# Altium project QMK_CTRL_V2.PrjPcb
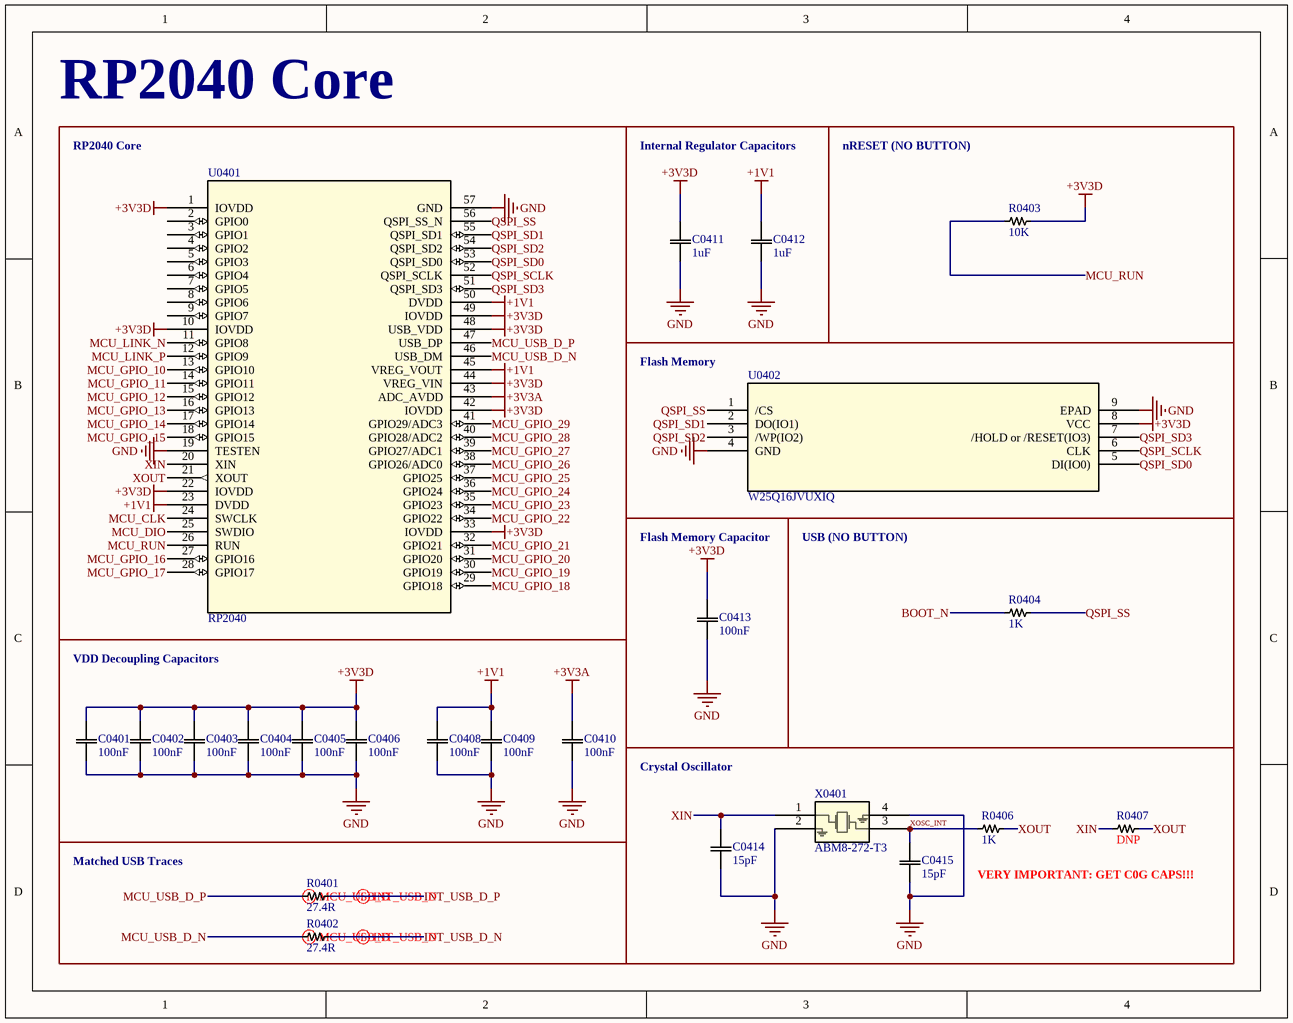
[diagram p0: rp2040_core.SchDoc]
3 sheets, 51 parts. Net scope: global (net labels, ports and power ports of the same name join across sheets).
Board file: main.PcbDoc
Sheets:
  rp2040_core.SchDoc
  peripherals.SchDoc
  sensor_array_interface.SchDoc

## Sheet rp2040_core.SchDoc
size A; SheetNumber: 1; SheetTotal: 3

### Parts
C0401  100nF  [CAPC10555_55N_KEM]
C0402  100nF  [CAPC10555_55N_KEM]
C0403  100nF  [CAPC10555_55N_KEM]
C0404  100nF  [CAPC10555_55N_KEM]
C0405  100nF  [CAPC10555_55N_KEM]
C0406  100nF  [CAPC10555_55N_KEM]
C0408  100nF  [CAPC10555_55N_KEM]
C0409  100nF  [CAPC10555_55N_KEM]
C0410  100nF  [CAPC10555_55N_KEM]
C0411  1uF  [CAPC10555_55N_KEM]
C0412  1uF  [CAPC10555_55N_KEM]
C0413  100nF  [CAPC10555_55N_KEM]
C0414  15pF  [CAPC10555_55N_KEM]
C0415  15pF  [CAPC10555_55N_KEM]
R0401  27.4R  [RES0402_CPF_TYCO_TYC]
R0402  27.4R  [RES0402_CPF_TYCO_TYC]
R0403  10K  [RES0402_CPF_TYCO_TYC]
R0404  1K  [RES0402_CPF_TYCO_TYC]
R0406  1K  [RES0402_CPF_TYCO_TYC]
R0407  DNP  [RES0402_CPF_TYCO_TYC]
U0401  RP2040  [IC57_RP2040]
U0402  W25Q16JVUXIQ  [W25Q16JVUXIQ_WIN]
X0401  ABM8-272-T3  [ABM8-272-T3_ABR]

### Blocks framed on the sheet
RP2040 Core: U0401
Internal Regulator Capacitors: C0411 C0412
nRESET (NO BUTTON): R0403
Flash Memory: U0402
Flash Memory Capacitor: C0413
USB (NO BUTTON): R0404
VDD Decoupling Capacitors: C0401 C0402 C0403 C0404 C0405 C0406 C0408 C0409 C0410
Matched USB Traces: R0401 R0402

### Nets
+1V1: C0408.2 C0409.2 C0412.2 U0401.23(DVDD) U0401.45(VREG_VOUT) U0401.50(DVDD)
+3V3A: C0410.2 U0401.43(ADC_AVDD)
+3V3D: C0401.2 C0402.2 C0403.2 C0404.2 C0405.2 C0406.2 C0411.2 C0413.2 R0403.1 U0401.1(IOVDD) U0401.10(IOVDD) U0401.22(IOVDD) U0401.33(IOVDD) U0401.42(IOVDD) U0401.44(VREG_VIN) U0401.48(USB_VDD) U0401.49(IOVDD) U0402.8(VCC)
GND: C0401.1 C0402.1 C0403.1 C0404.1 C0405.1 C0406.1 C0408.1 C0409.1 C0410.1 C0411.1 C0412.1 C0413.1 C0414.2 C0415.1 U0401.19(TESTEN) U0401.57(GND) U0402.4(GND) U0402.9(EPAD) X0401.2 X0401.4
BOOT_N: R0404.2
INT_USB_D_N: R0402.1
INT_USB_D_P: R0401.1
MCU_CLK: U0401.24(SWCLK)
MCU_DIO: U0401.25(SWDIO)
MCU_GPIO_10: U0401.13(GPIO10)
MCU_GPIO_11: U0401.14(GPIO11)
MCU_GPIO_12: U0401.15(GPIO12)  [project net FPC_GPIO_12]
MCU_GPIO_13: U0401.16(GPIO13)
MCU_GPIO_14: U0401.17(GPIO14)  [project net FPC_GPIO_14]
MCU_GPIO_15: U0401.18(GPIO15)  [project net FPC_GPIO_15]
MCU_GPIO_16: U0401.27(GPIO16)  [project net FPC_GPIO_16]
MCU_GPIO_17: U0401.28(GPIO17)
MCU_GPIO_18: U0401.29(GPIO18)
MCU_GPIO_19: U0401.30(GPIO19)
MCU_GPIO_20: U0401.31(GPIO20)  [project net FPC_GPIO_20]
MCU_GPIO_21: U0401.32(GPIO21)  [project net FPC_GPIO_21]
MCU_GPIO_22: U0401.34(GPIO22)  [project net FPC_GPIO_22]
MCU_GPIO_23: U0401.35(GPIO23)  [project net FPC_GPIO_23]
MCU_GPIO_24: U0401.36(GPIO24)  [project net FPC_GPIO_24]
MCU_GPIO_25: U0401.37(GPIO25)  [project net FPC_GPIO_25]
MCU_GPIO_26: U0401.38(GPIO26/ADC0)  [project net FPC_GPIO_26]
MCU_GPIO_27: U0401.39(GPIO27/ADC1)  [project net FPC_GPIO_27]
MCU_GPIO_28: U0401.40(GPIO28/ADC2)  [project net FPC_GPIO_28]
MCU_GPIO_29: U0401.41(GPIO29/ADC3)  [project net FPC_GPIO_29]
MCU_LINK_N: U0401.11(GPIO8)
MCU_LINK_P: U0401.12(GPIO9)
MCU_RUN: R0403.2 U0401.26(RUN)
MCU_USB_D_N: R0402.2 U0401.46(USB_DM)
MCU_USB_D_P: R0401.2 U0401.47(USB_DP)
QSPI_SCLK: U0401.52(QSPI_SCLK) U0402.6(CLK)
QSPI_SD0: U0401.53(QSPI_SD0) U0402.5(DI(IO0))
QSPI_SD1: U0401.55(QSPI_SD1) U0402.2(DO(IO1))
QSPI_SD2: U0401.54(QSPI_SD2) U0402.3(/WP(IO2))
QSPI_SD3: U0401.51(QSPI_SD3) U0402.7(/HOLD_or_/RESET(IO3))
QSPI_SS: R0404.1 U0401.56(QSPI_SS_N) U0402.1(/CS)
XIN: C0414.1 R0407.1 U0401.20(XIN) X0401.1
XOSC_INT: C0415.2 R0406.1 X0401.3
XOUT: R0406.2 R0407.2 U0401.21(XOUT)

Not connected (* = marked no-connect by the designer): U0401 2(GPIO0) 3(GPIO1) 4(GPIO2) 5(GPIO3) 6(GPIO4) 7(GPIO5) 8(GPIO6) 9(GPIO7)

### Layout directives
differential pair: INT_USB_D_N, INT_USB_D_P, MCU_USB_D_N, MCU_USB_D_P

### Notes on the sheet
- RP2040 Core
- Crystal Oscillator
- VERY IMPORTANT: GET C0G CAPS!!!

### Library data of the parts
C0401 C0402 C0403 C0404 C0405 C0406 C0408 C0409 C0410 C0411 C0412 C0413 C0414 C0415 = C0402: SMD Comm X7R, Ceramic, SMD, MLCC, Temperature Stable, 0402; Manufacturer_Name: Kemet; Manufacturer_Part_Number: C0402C104K4RACTU; Copyright: Copyright (C) 2025 Ultra Librarian. All rights reserved.; Datasheet: https://content.kemet.com/datasheets/KEM_C1002_X7R_SMD.pdf
R0401 R0402 R0403 R0404 R0406 R0407 = R0402: CPF 0402 RL; Manufacturer_Name: TE Connectivity; Manufacturer_Part_Number: CPF0402B33RE1; Copyright: Copyright (C) 2025 Ultra Librarian. All rights reserved.; Datasheet: https://www.te.com/commerce/DocumentDelivery/DDEController?Action=srchrtrv&DocNm=1773200&DocType=Data+Sheet&DocLang=English&PartCntxt=1-1879208-3&DocFormat=pdf
U0401 = RP2040: No Description Available; Manufacturer_Name: Raspberry Pi; Copyright: Copyright (C) 2025 Ultra Librarian. All rights reserved.; Manufacturer_Part_Number: RP2040; RefDes: RefDes; Type: Type
U0402 = W25Q16JVUXIQ: No Description Available; Manufacturer_Name: Winbond; Copyright: Copyright (C) 2025 Ultra Librarian. All rights reserved.; Manufacturer_Part_Number: W25Q16JVUXIQ; RefDes: RefDes; Type: Type
X0401 = ABM8-272-T3: No Description Available; Manufacturer_Name: Abracon; Type: Crystals; Copyright: Copyright (C) 2025 Ultra Librarian. All rights reserved.; Manufacturer_Part_Number: ABM8-272-T3; RefDes: RefDes

## Sheet peripherals.SchDoc
size A portrait; SheetNumber: 2; SheetTotal: 3
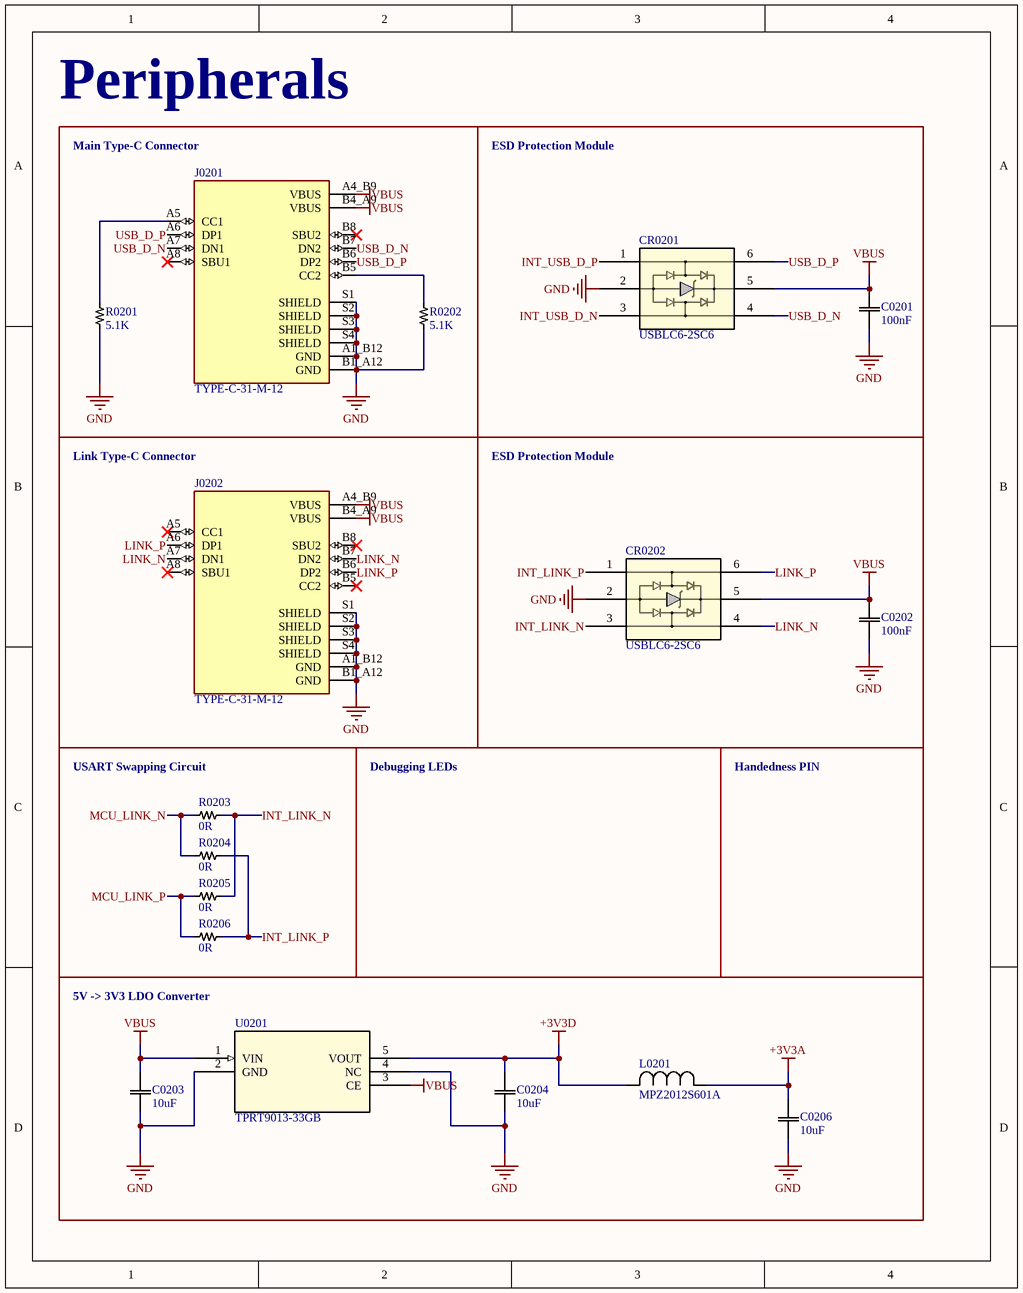
[diagram p1: peripherals.SchDoc]

### Parts
C0201  100nF  [CAPC10555_55N_KEM]
C0202  100nF  [CAPC10555_55N_KEM]
C0203  10uF  [CAPC10555_55N_KEM]
C0204  10uF  [CAPC10555_55N_KEM]
C0206  10uF  [CAPC10555_55N_KEM]
CR0201  USBLC6-2SC6  [SOT23-6L_STM]
CR0202  USBLC6-2SC6  [SOT23-6L_STM]
J0201  TYPE-C-31-M-12  [HRO_TYPE-C-31-M-12]
J0202  TYPE-C-31-M-12  [HRO_TYPE-C-31-M-12]
L0201  MPZ2012S601A  [IND_MPZ2012_TDK]
R0201  5.1K  [RES0402_CPF_TYCO_TYC]
R0202  5.1K  [RES0402_CPF_TYCO_TYC]
R0203  0R  [RES0402_CPF_TYCO_TYC]
R0204  0R  [RES0402_CPF_TYCO_TYC]
R0205  0R  [RES0402_CPF_TYCO_TYC]
R0206  0R  [RES0402_CPF_TYCO_TYC]
U0201  TPRT9013-33GB  [SOT23-5_TCP]

### Blocks framed on the sheet
Peripherals: J0201 R0201 R0202
ESD Protection Module: C0201 CR0201
Link Type-C Connector: J0202
ESD Protection Module: C0202 CR0202
5V -> 3V3 LDO Converter: C0203 C0204 C0206 L0201 U0201

### Nets
+3V3A: C0206.2 L0201.1
+3V3D: C0204.2 L0201.2 U0201.5(VOUT)
GND: C0201.1 C0202.1 C0203.1 C0204.1 C0206.1 CR0201.2 CR0202.2 J0201.A1_B12(GND) J0201.B1_A12(GND) J0201.S1(SHIELD) J0201.S2(SHIELD) J0201.S3(SHIELD) J0201.S4(SHIELD) J0202.A1_B12(GND) J0202.B1_A12(GND) J0202.S1(SHIELD) J0202.S2(SHIELD) J0202.S3(SHIELD) J0202.S4(SHIELD) R0201.1 R0202.1 U0201.2(GND) U0201.4(NC)
VBUS: C0201.2 C0202.2 C0203.2 CR0201.5 CR0202.5 J0201.A4_B9(VBUS) J0201.B4_A9(VBUS) J0202.A4_B9(VBUS) J0202.B4_A9(VBUS) U0201.1(VIN) U0201.3(CE)
INT_LINK_N: CR0202.3 R0203.1 R0205.1
INT_LINK_P: CR0202.1 R0204.1 R0206.1
INT_USB_D_N: CR0201.3
INT_USB_D_P: CR0201.1
LINK_N: CR0202.4 J0202.A7(DN1) J0202.B7(DN2)
LINK_P: CR0202.6 J0202.A6(DP1) J0202.B6(DP2)
MCU_LINK_N: R0203.2 R0204.2
MCU_LINK_P: R0205.2 R0206.2
USB_D_N: CR0201.4 J0201.A7(DN1) J0201.B7(DN2)
USB_D_P: CR0201.6 J0201.A6(DP1) J0201.B6(DP2)
NetJ0201_A5: J0201.A5(CC1) R0201.2
NetJ0201_B5: J0201.B5(CC2) R0202.2

Not connected (* = marked no-connect by the designer): J0201 A8(SBU1)* B8(SBU2)*; J0202 A5(CC1)* A8(SBU1)* B5(CC2)* B8(SBU2)*

### Notes on the sheet
- (near J0201) Main Type-C Connector
- (near R0203) USART Swapping Circuit
- Debugging LEDs
- Handedness PIN

### Library data of the parts
C0201 C0202 C0203 C0204 C0206 = C0402: as C0401 on sheet rp2040_core; Copyright: Copyright (C) 2025 Ultra Librarian. All rights reserved.; Datasheet: https://content.kemet.com/datasheets/KEM_C1002_X7R_SMD.pdf
CR0201 CR0202 = USBLC6-2SC6: ESD Protection for USB 2.0 High Speed; Manufacturer_Name: STMicroelectronics; Copyright: Copyright (C) 2025 Ultra Librarian. All rights reserved.; Manufacturer_Part_Number: USBLC6-2SC6; Datasheet: https://www.st.com/resource/en/datasheet/usblc6-2.pdf; RefDes: RefDes; Type: Type
J0201 J0202 = TYPE-C-31-M-12: USB Connectors 24 Receptacle 1 8.94*7.3mm RoHS; MF: HRO Electronics Co., Ltd.; SnapEDA_Link: https://www.snapeda.com/parts/TYPE-C-31-M-12/HRO+Electronics+Co.%252C+Ltd./view-part/?ref=snap; Package: Package; Value: *; MP: TYPE-C-31-M-12; Check_prices: https://www.snapeda.com/parts/TYPE-C-31-M-12/HRO+Electronics+Co.%252C+Ltd./view-part/?ref=eda
L0201 = MPZ2012S601A: No Description Available; Manufacturer_Name: TDK; Copyright: Copyright (C) 2025 Ultra Librarian. All rights reserved.; Manufacturer_Part_Number: MPZ2012S601A
R0201 R0202 R0203 R0204 R0205 R0206 = R0402: as R0401 on sheet rp2040_core; Copyright: Copyright (C) 2025 Ultra Librarian. All rights reserved.; Datasheet: https://www.te.com/commerce/DocumentDelivery/DDEController?Action=srchrtrv&DocNm=1773200&DocType=Data+Sheet&DocLang=English&PartCntxt=1-1879208-3&DocFormat=pdf
U0201 = TPRT9013-33GB: No Description Available; Manufacturer_Name: Tech Public; Type: Power Management; Copyright: Copyright (C) 2025 Ultra Librarian. All rights reserved.; Manufacturer_Part_Number: TPRT9013-33GB; RefDes: RefDes

## Sheet sensor_array_interface.SchDoc
size A portrait; SheetNumber: 3; SheetTotal: 3
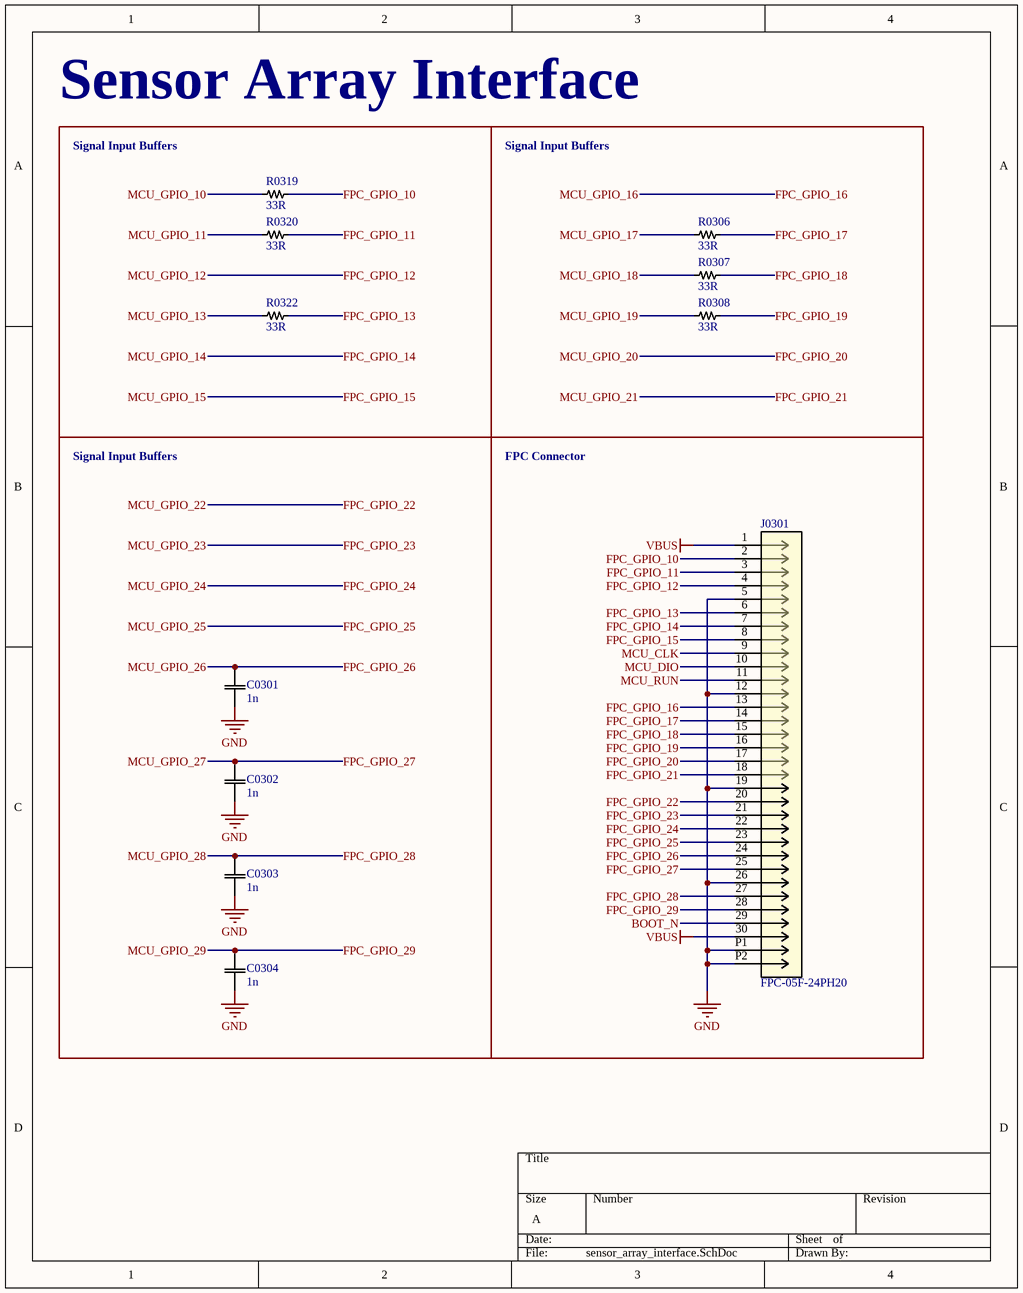
[diagram p2: sensor_array_interface.SchDoc]

### Parts
C0301  1n  [CAPC10555_55N_KEM]
C0302  1n  [CAPC10555_55N_KEM]
C0303  1n  [CAPC10555_55N_KEM]
C0304  1n  [CAPC10555_55N_KEM]
J0301  FPC-05F-24PH20  [FPC-05F-30PH20]
R0306  33R  [RES0402_CPF_TYCO_TYC]
R0307  33R  [RES0402_CPF_TYCO_TYC]
R0308  33R  [RES0402_CPF_TYCO_TYC]
R0319  33R  [RES0402_CPF_TYCO_TYC]
R0320  33R  [RES0402_CPF_TYCO_TYC]
R0322  33R  [RES0402_CPF_TYCO_TYC]

### Blocks framed on the sheet
Sensor Array Interface: R0319 R0320 R0322
Signal Input Buffers: R0306 R0307 R0308
Signal Input Buffers: C0301 C0302 C0303 C0304
FPC Connector: J0301

### Nets
GND: C0301.1 C0302.1 C0303.1 C0304.1 J0301.5 J0301.12 J0301.19 J0301.26 J0301.P1 J0301.P2
VBUS: J0301.1 J0301.30
BOOT_N: J0301.29
FPC_GPIO_10: J0301.2 R0319.1
FPC_GPIO_11: J0301.3 R0320.1
FPC_GPIO_12: J0301.4  [also labelled MCU_GPIO_12]
FPC_GPIO_13: J0301.6 R0322.1
FPC_GPIO_14: J0301.7  [also labelled MCU_GPIO_14]
FPC_GPIO_15: J0301.8  [also labelled MCU_GPIO_15]
FPC_GPIO_16: J0301.13  [also labelled MCU_GPIO_16]
FPC_GPIO_17: J0301.14 R0306.1
FPC_GPIO_18: J0301.15 R0307.1
FPC_GPIO_19: J0301.16 R0308.1
FPC_GPIO_20: J0301.17  [also labelled MCU_GPIO_20]
FPC_GPIO_21: J0301.18  [also labelled MCU_GPIO_21]
FPC_GPIO_22: J0301.20  [also labelled MCU_GPIO_22]
FPC_GPIO_23: J0301.21  [also labelled MCU_GPIO_23]
FPC_GPIO_24: J0301.22  [also labelled MCU_GPIO_24]
FPC_GPIO_25: J0301.23  [also labelled MCU_GPIO_25]
FPC_GPIO_26: C0301.2 J0301.24  [also labelled MCU_GPIO_26]
FPC_GPIO_27: C0302.2 J0301.25  [also labelled MCU_GPIO_27]
FPC_GPIO_28: C0303.2 J0301.27  [also labelled MCU_GPIO_28]
FPC_GPIO_29: C0304.2 J0301.28  [also labelled MCU_GPIO_29]
MCU_CLK: J0301.9
MCU_DIO: J0301.10
MCU_GPIO_10: R0319.2
MCU_GPIO_11: R0320.2
MCU_GPIO_13: R0322.2
MCU_GPIO_17: R0306.2
MCU_GPIO_18: R0307.2
MCU_GPIO_19: R0308.2
MCU_RUN: J0301.11

### Notes on the sheet
- Signal Input Buffers

### Library data of the parts
C0301 C0302 C0303 C0304 = C0402: as C0401 on sheet rp2040_core; Copyright: Copyright (C) 2025 Ultra Librarian. All rights reserved.; Datasheet: https://content.kemet.com/datasheets/KEM_C1002_X7R_SMD.pdf
J0301 = FPC-05F-24PH20_1: 24 Pin 0.5 Pitch FPC connector
R0306 R0307 R0308 R0319 R0320 R0322 = R0402: as R0401 on sheet rp2040_core; Copyright: Copyright (C) 2025 Ultra Librarian. All rights reserved.; Datasheet: https://www.te.com/commerce/DocumentDelivery/DDEController?Action=srchrtrv&DocNm=1773200&DocType=Data+Sheet&DocLang=English&PartCntxt=1-1879208-3&DocFormat=pdf

## Nets that join several sheets
+3V3A: rp2040_core (C0410.2 U0401.43), peripherals (C0206.2 L0201.1)
+3V3D: rp2040_core (18 pins), peripherals (C0204.2 L0201.2 U0201.5)
GND: rp2040_core (20 pins), peripherals (23 pins), sensor_array_interface (10 pins)
VBUS: peripherals (11 pins), sensor_array_interface (J0301.1 J0301.30)
BOOT_N: rp2040_core (R0404.2), sensor_array_interface (J0301.29)
FPC_GPIO_12: rp2040_core (U0401.15), sensor_array_interface (J0301.4)
FPC_GPIO_14: rp2040_core (U0401.17), sensor_array_interface (J0301.7)
FPC_GPIO_15: rp2040_core (U0401.18), sensor_array_interface (J0301.8)
FPC_GPIO_16: rp2040_core (U0401.27), sensor_array_interface (J0301.13)
FPC_GPIO_20: rp2040_core (U0401.31), sensor_array_interface (J0301.17)
FPC_GPIO_21: rp2040_core (U0401.32), sensor_array_interface (J0301.18)
FPC_GPIO_22: rp2040_core (U0401.34), sensor_array_interface (J0301.20)
FPC_GPIO_23: rp2040_core (U0401.35), sensor_array_interface (J0301.21)
FPC_GPIO_24: rp2040_core (U0401.36), sensor_array_interface (J0301.22)
FPC_GPIO_25: rp2040_core (U0401.37), sensor_array_interface (J0301.23)
FPC_GPIO_26: rp2040_core (U0401.38), sensor_array_interface (C0301.2 J0301.24)
FPC_GPIO_27: rp2040_core (U0401.39), sensor_array_interface (C0302.2 J0301.25)
FPC_GPIO_28: rp2040_core (U0401.40), sensor_array_interface (C0303.2 J0301.27)
FPC_GPIO_29: rp2040_core (U0401.41), sensor_array_interface (C0304.2 J0301.28)
INT_USB_D_N: rp2040_core (R0402.1), peripherals (CR0201.3)
INT_USB_D_P: rp2040_core (R0401.1), peripherals (CR0201.1)
MCU_CLK: rp2040_core (U0401.24), sensor_array_interface (J0301.9)
MCU_DIO: rp2040_core (U0401.25), sensor_array_interface (J0301.10)
MCU_GPIO_10: rp2040_core (U0401.13), sensor_array_interface (R0319.2)
MCU_GPIO_11: rp2040_core (U0401.14), sensor_array_interface (R0320.2)
MCU_GPIO_13: rp2040_core (U0401.16), sensor_array_interface (R0322.2)
MCU_GPIO_17: rp2040_core (U0401.28), sensor_array_interface (R0306.2)
MCU_GPIO_18: rp2040_core (U0401.29), sensor_array_interface (R0307.2)
MCU_GPIO_19: rp2040_core (U0401.30), sensor_array_interface (R0308.2)
MCU_LINK_N: rp2040_core (U0401.11), peripherals (R0203.2 R0204.2)
MCU_LINK_P: rp2040_core (U0401.12), peripherals (R0205.2 R0206.2)
MCU_RUN: rp2040_core (R0403.2 U0401.26), sensor_array_interface (J0301.11)